# EAGLE design PCF8575_Shield (EAGLE 7.4.0)
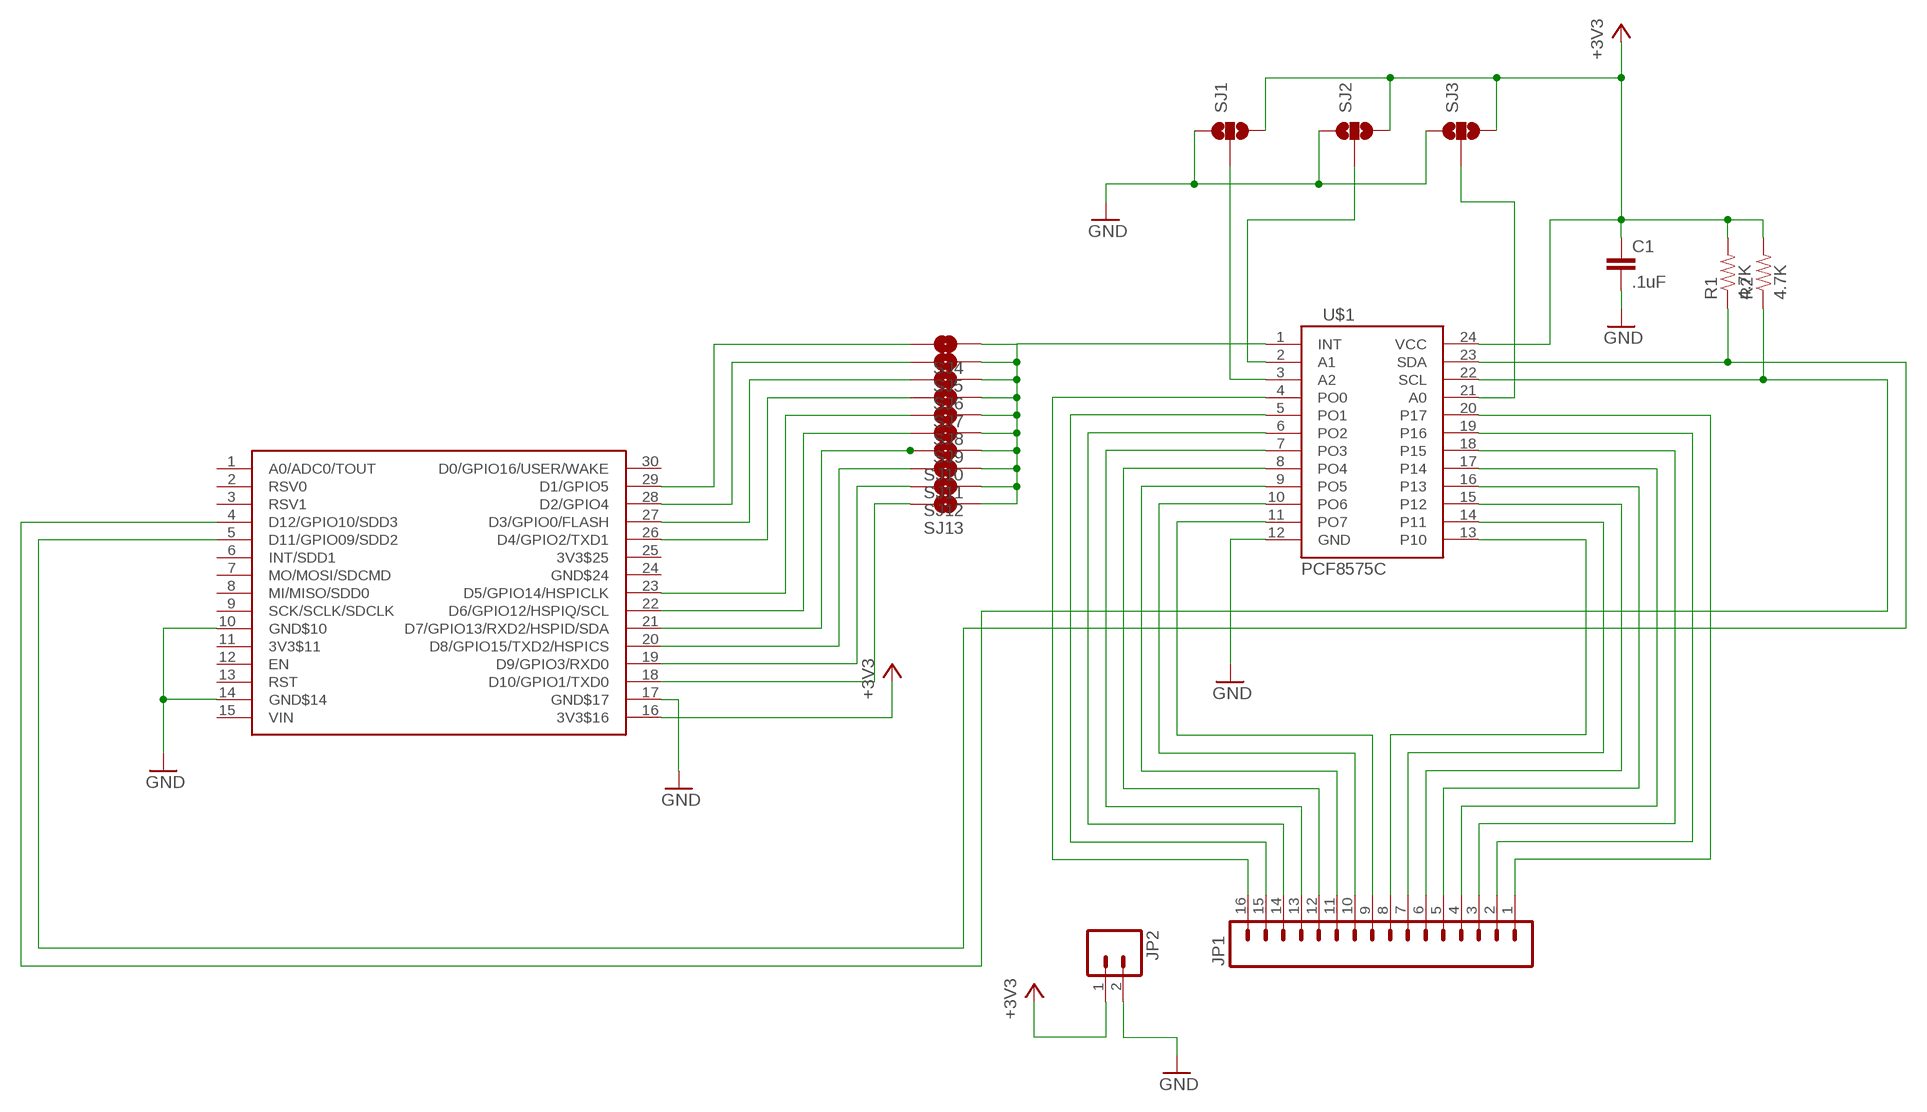
[diagram p0: schematic, sheet 1]

## Parts
C1  .1uF  CAP0603-CAP  [0603-CAP]
JP1  M161X16_NO_SILK  [1X16_NO_SILK]
JP2  M02PTH  [1X02]
R1  4.7K  RESISTOR0603-RES  [0603-RES]
R2  4.7K  RESISTOR0603-RES  [0603-RES]
SJ1  SOLDERJUMPER_2WAYPASTE1&2  [SJ_3_PASTE1&2]
SJ2  SOLDERJUMPER_2WAYPASTE1&2  [SJ_3_PASTE1&2]
SJ3  SOLDERJUMPER_2WAYPASTE1&2  [SJ_3_PASTE1&2]
SJ4  SOLDERJUMPERNO  [SJ_2S-NO]
SJ5  SOLDERJUMPERNO  [SJ_2S-NO]
SJ6  SOLDERJUMPERNO  [SJ_2S-NO]
SJ7  SOLDERJUMPERNO  [SJ_2S-NO]
SJ8  SOLDERJUMPERNO  [SJ_2S-NO]
SJ9  SOLDERJUMPERNO  [SJ_2S-NO]
SJ10  SOLDERJUMPERNO  [SJ_2S-NO]
SJ11  SOLDERJUMPERNO  [SJ_2S-NO]
SJ12  SOLDERJUMPERNO  [SJ_2S-NO]
SJ13  SOLDERJUMPERNO  [SJ_2S-NO]
U$1  PCF8575C  [SO-24DW]
U$2  NERDSHIELD  [NERDUINO_STACK]

## Nets
+3V3: C1.1 JP2.1 R1.2 R2.2 SJ1.3 SJ2.3 SJ3.3 U$1.24(VCC) U$2.16(3V3$16)
GND: C1.2 JP2.2 SJ1.1 SJ2.1 SJ3.1 U$1.12(GND) U$2.10(GND$10) U$2.14(GND$14) U$2.17(GND$17)
N$1: JP1.1 U$1.20(P17)
N$2: R1.1 U$1.23(SDA) U$2.5(D11/GPIO09/SDD2)
N$3: SJ4.1 SJ5.1 SJ6.1 SJ7.1 SJ8.1 SJ9.1 SJ10.1 SJ11.1 SJ12.1 SJ13.1 U$1.1(INT)
N$4: SJ3.2 U$1.21(A0)
N$5: R2.1 U$1.22(SCL) U$2.4(D12/GPIO10/SDD3)
N$6: SJ2.2 U$1.2(A1)
N$7: JP1.2 U$1.19(P16)
N$8: SJ1.2 U$1.3(A2)
N$9: JP1.3 U$1.18(P15)
N$10: JP1.4 U$1.17(P14)
N$11: JP1.5 U$1.16(P13)
N$12: JP1.6 U$1.15(P12)
N$13: JP1.7 U$1.14(P11)
N$14: JP1.8 U$1.13(P10)
N$15: JP1.9 U$1.11(PO7)
N$16: JP1.10 U$1.10(PO6)
N$17: JP1.11 U$1.9(PO5)
N$18: JP1.12 U$1.8(PO4)
N$19: JP1.13 U$1.7(PO3)
N$20: JP1.14 U$1.6(PO2)
N$21: JP1.15 U$1.5(PO1)
N$22: JP1.16 U$1.4(PO0)
N$23: SJ4.2 U$2.29(D1/GPIO5)
N$24: SJ5.2 U$2.28(D2/GPIO4)
N$25: SJ6.2 U$2.27(D3/GPIO0/FLASH)
N$26: SJ7.2 U$2.26(D4/GPIO2/TXD1)
N$27: SJ8.2 U$2.23(D5/GPIO14/HSPICLK)
N$28: SJ9.2 U$2.22(D6/GPIO12/HSPIQ/SCL)
N$29: SJ10.2 U$2.21(D7/GPIO13/RXD2/HSPID/SDA)
N$30: SJ11.2 U$2.20(D8/GPIO15/TXD2/HSPICS)
N$31: SJ12.2 U$2.19(D9/GPIO3/RXD0)
N$32: SJ13.2 U$2.18(D10/GPIO1/TXD0)
Unconnected: U$2.1(A0/ADC0/TOUT) U$2.2(RSV0) U$2.3(RSV1) U$2.6(INT/SDD1) U$2.7(MO/MOSI/SDCMD) U$2.8(MI/MISO/SDD0) U$2.9(SCK/SCLK/SDCLK) U$2.11(3V3$11) U$2.12(EN) U$2.13(RST) U$2.15(VIN) U$2.24(GND$24) U$2.25(3V3$25) U$2.30(D0/GPIO16/USER/WAKE)

## Library data of the parts
C1 = SparkFun:CAP: Capacitor Standard 0603 ceramic capacitor, and 0.1" leaded capacitor.
JP1 = SparkFun-Connectors:M16: 1x16 .1" header
JP2 = SparkFun:M02: Header 2 Standard 2-pin 0.1" header. Use with straight break away headers (SKU : PRT-00116), right angle break away headers (PRT-00553), swiss pins (PRT-00743), machine pins (PRT-00117), and female headers (PRT-00115). Molex polarized connector foot print use with SKU : PRT-08233 with associated crimp pins and housings.
R1 R2 = SparkFun:RESISTOR: Resistor Basic schematic elements and footprints for 0603, 1206, and PTH resistors.
SJ1-SJ3 = SparkFun:SOLDERJUMPER_2WAY: Solder Jumper 2 way solder jumper
SJ4-SJ13 = SparkFun:SOLDERJUMPER: Solder Jumper Standard SMD solder jumper. Used to automate production. Two varients : Normally Open and Normally Closed are the same, but have different paste layers. NC will have a large amount of paste and should jumper during reflow.
U$1 = SparkFun:PCF8575C: PCF8575C I/O Expander.
U$2 = NerduinoShieldLib:NERDSHIELD

## Board
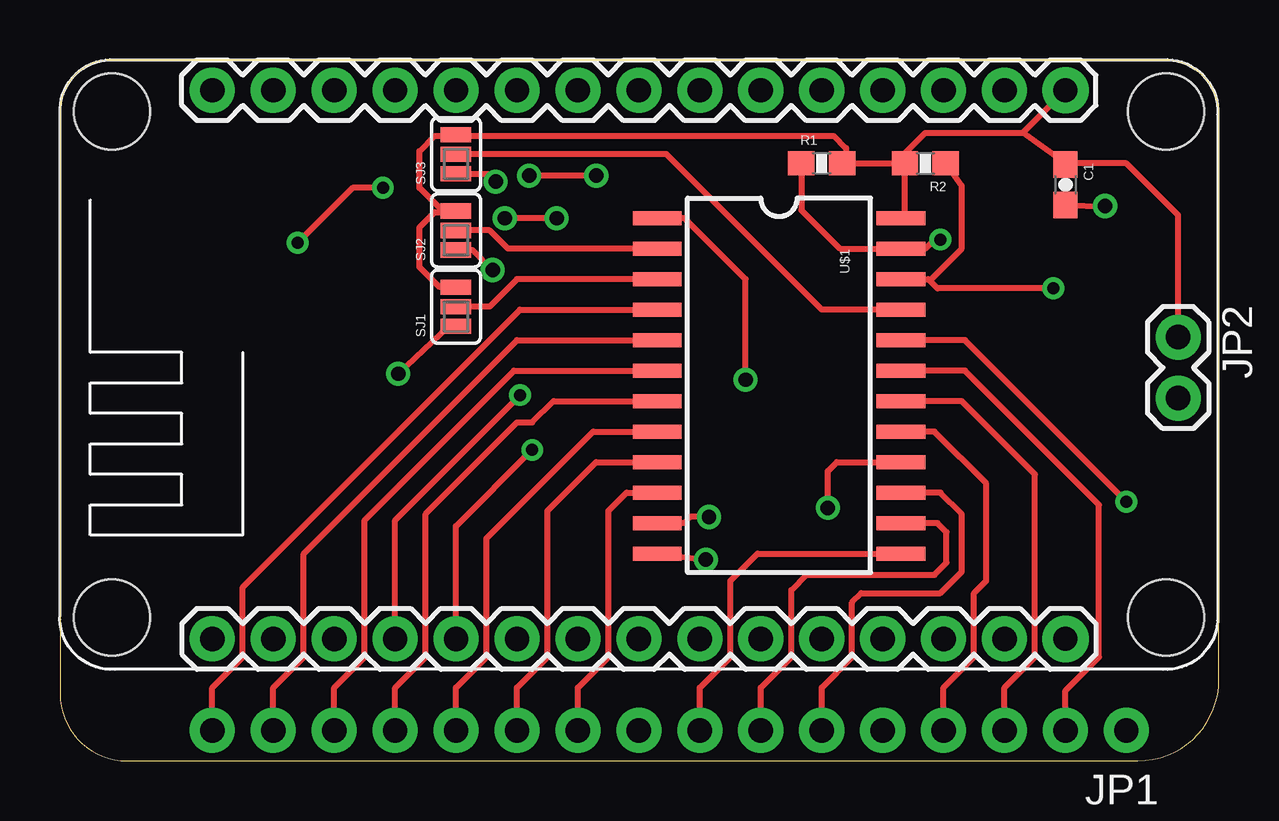
[diagram p1: board, top side]
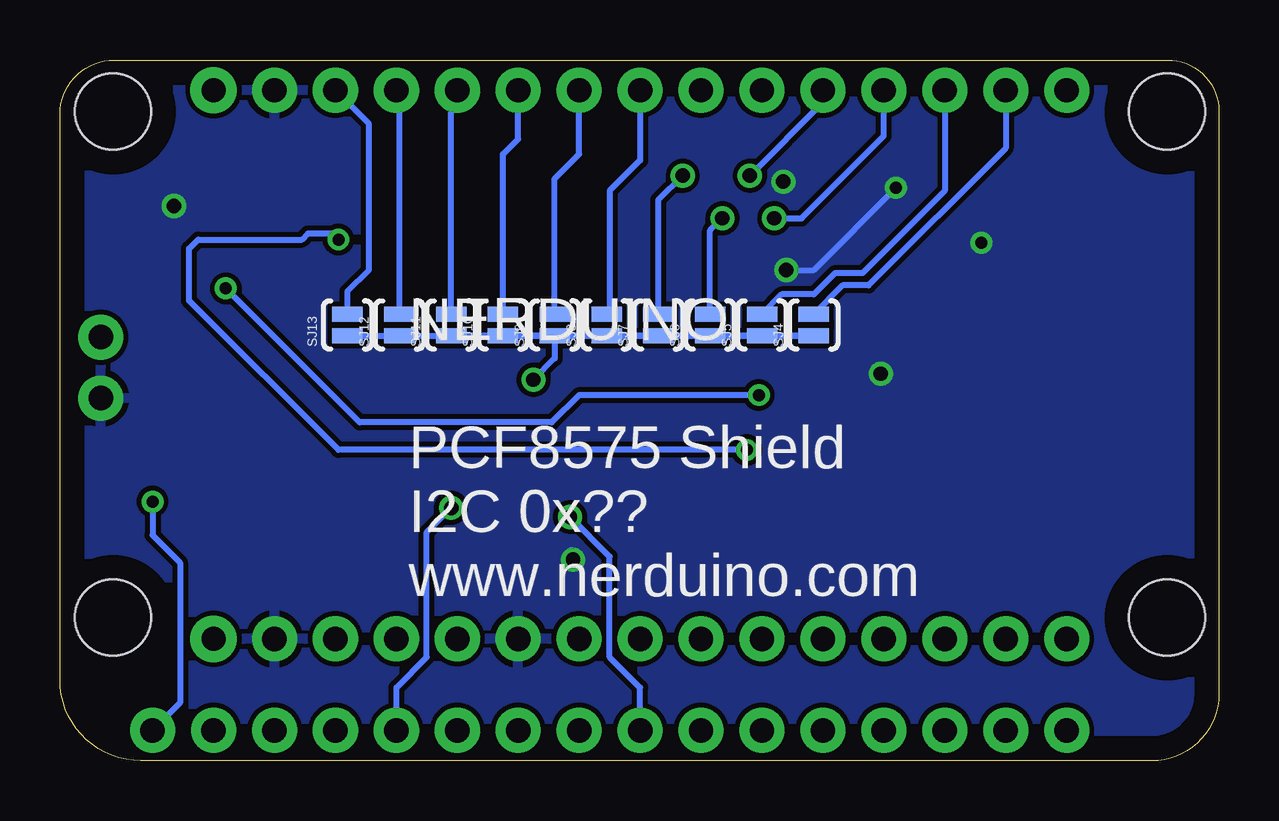
[diagram p2: board, bottom side, seen from below]

Size 48.31 x 29.2 mm. Coordinates in mm from the lower left corner, seen from the top.
Outline: 0,27.05 0,2.79 arc90 2.79,0 44.94,0 arc90 48.31,3.37 48.31,26.94 arc90 46.05,29.2 2.15,29.2 arc90 0,27.05
Copper layers (1*16): Top 0.035mm / dielectric 1.5mm / Bottom 0.035mm
Design rules "default": minimum track width 10mil, minimum drill 24mil, track to track 8mil, track to pad 8mil, pad to pad 8mil, via to via 8mil, smd to smd 8mil, copper to edge 40mil, drill to drill 8mil, minimum pad ring 10mil, minimum via ring 8mil, stop-mask expansion 4mil, vias tented up to drill 0mil, thermal gap 10mil

### Footprints (pad centres in the part's own frame; a part is rotated, then mirrored left to right if it is on the bottom)
0603-CAP = smd 1.1 x 1: 1 -0.85,0; 2 0.85,0
1X16_NO_SILK = drill 1.016 pad 1.88: 1 0,0; 2 2.54,0; 3 5.08,0; 4 7.62,0; 5 10.16,0; 6 12.7,0; 7 15.24,0; 8 17.78,0; 9 20.32,0; 10 22.86,0; 11 25.4,0; 12 27.94,0; 13 30.48,0; 14 33.02,0; 15 35.56,0; 16 38.1,0
1X02 = drill 1.016 pad 1.88: 1 0,0; 2 2.54,0
0603-RES = smd 1.1 x 1: 1 -0.85,0; 2 0.85,0
SJ_3_PASTE1&2 = smd 0.635 x 1.27: 1 -0.813,0; 2 0,0; 3 0.813,0
SJ_2S-NO = smd 0.635 x 1.27: 1 -0.45,0; 2 0.45,0
SO-24DW = smd 0.584 x 2.032: 1 -6.35,-5.08; 2 -5.08,-5.08; 3 -3.81,-5.08; 4 -2.54,-5.08; 5 -1.27,-5.08; 6 0,-5.08; 7 1.27,-5.08; 8 2.54,-5.08; 9 3.81,-5.08; 10 5.08,-5.08; 11 6.35,-5.08; 12 7.62,-5.08; 13 7.62,5.08; 14 6.35,5.08; 15 5.08,5.08; 16 3.81,5.08; 17 2.54,5.08; 18 1.27,5.08; 19 0,5.08; 20 -1.27,5.08; 21 -2.54,5.08; 22 -3.81,5.08; 23 -5.08,5.08; 24 -6.35,5.08
NERDUINO_STACK = drill 1.016 pad 1.88: 1 -17.78,-5.08; 2 -15.24,-5.08; 3 -12.7,-5.08; 4 -10.16,-5.08; 5 -7.62,-5.08; 6 -5.08,-5.08; 7 -2.54,-5.08; 8 0,-5.08; 9 2.54,-5.08; 10 5.08,-5.08; 11 7.62,-5.08; 12 10.16,-5.08; 13 12.7,-5.08; 14 15.24,-5.08; 17 15.24,17.78; 18 12.7,17.78; 19 10.16,17.78; 20 7.62,17.78; 21 5.08,17.78; 22 2.54,17.78; 23 0,17.78; 24 -2.54,17.78; 25 -5.08,17.78; 26 -7.62,17.78; 27 -10.16,17.78; 28 -12.7,17.78; 29 -15.24,17.78; 30 -17.78,17.78 | drill 1 pad 1.93: 15 17.78,-5.08; 16 17.78,17.78 | hole 3.175: -21.971,16.891; -21.971,-4.191; 21.971,-4.191; 21.971,16.891

### Placement (x,y rotation side)
C1  41.91,24 270 top
JP1  44.45,1.27 180 top
JP2  46.61,17.65 270 top
R1  31.75,24.89 0 top
R2  36.07,24.89 180 top
SJ1  16.51,18.92 90 top
SJ2  16.51,22.1 90 top
SJ3  16.51,25.27 90 top
SJ4  16.89,18.16 90 bottom
SJ5  19.05,18.16 90 bottom
SJ6  21.21,18.16 90 bottom
SJ7  23.37,18.16 90 bottom
SJ8  25.53,18.16 90 bottom
SJ9  27.69,18.16 90 bottom
SJ10  29.84,18.16 90 bottom
SJ11  32,18.16 90 bottom
SJ12  34.16,18.16 90 bottom
SJ13  36.32,18.16 90 bottom
U$1  29.97,16.26 270 top
U$2  24.13,10.16 0 top

### Tracks (layer width: path | path; a pad name or v marks a point on that pad's centre or on a via)
+3V3
  Top 0.254: U$1.24 35.22,22.61 R2.2 | R2.2 35.22,25.31 36.07,26.16 40.13,26.16 | 40.13,26.16 U$2.16 | R2.2 R1.2 32.77,25.06 32.77,25.53 32.26,26.04 16.56,26.04 SJ3.3 16.46,26.04 15.62,26.04 14.99,25.4 14.99,23.88 15.95,22.91 SJ2.3 16.46,22.86 15.62,22.86 14.99,22.23 14.99,20.57 15.82,19.74 SJ1.3 | 40.13,26.16 41.91,24.89 C1.1 41.91,25.15 42.16,24.89 44.45,24.89 46.61,22.73 JP2.1
GND  (via drill 0.5, 0.6)
  Top 0.254: C1.2 v43.56,23.11 | U$1.12 v26.92,8.38 | SJ1.1 16.2,18.11 v14.1,16.13 | SJ3.1 17.83,24.46 v18.16,24.13 | SJ2.1 17.2,21.29 v18.03,20.45 | v13.46,23.88 12.19,23.88 v9.91,21.59
  Bottom 0.254: v43.56,23.11 43.82,22.99 | v26.92,8.38 26.92,8.76 27.05,8.76 | v14.1,16.13 14.1,16.26 | v18.16,24.13 18.29,24.13 18.41,24 | 18.16,20.57 v18.03,20.45 16.89,20.45 v13.46,23.88 | v9.91,21.59 9.91,21.34
  pour Bottom: 0.13,29.08 48.26,29.21 48.26,0.25 0.13,0.13
N$1  (via drill 0.5)
  Top 0.254: v44.45,10.79 37.72,17.53 U$1.20
  Bottom 0.254: v44.45,10.79 44.45,9.4 43.31,8.26 43.31,2.41 JP1.1
N$2  (via drill 0.5)
  Top 0.254: R1.1 30.9,22.95 32.51,21.34 U$1.23 36.07,21.34 36.45,21.72 v36.7,21.72 | U$2.5 16.51,9.78 v19.68,12.95
  Bottom 0.254: v19.68,12.95 36.7,12.95 42.93,19.18 42.93,21.34 42.55,21.72 38.23,21.72 37.97,21.97 36.96,21.97 v36.7,21.72
N$3  (via drill 0.6)
  Top 0.254: v28.57,15.88 28.57,20.07 26.04,22.61 U$1.1
  Bottom 0.254: SJ13.1 SJ12.1 SJ4.1 SJ5.1 SJ6.1 SJ7.1 SJ8.1 SJ9.1 | SJ9.1 27.69,16.76 v28.57,15.88 | SJ9.1 SJ10.1 SJ11.1
N$4
  Top 0.254: U$1.21 31.75,18.8 25.27,25.27 SJ3.2
N$5  (via drill 0.5)
  Top 0.254: U$1.22 36.2,20.07 | 36.2,20.07 36.32,20.07 37.59,21.34 37.59,23.96 R2.1 | U$2.4 13.97,10.03 v19.18,15.24 | v41.4,19.68 36.58,19.68 36.2,20.07
  Bottom 0.254: v19.18,15.24 26.67,15.24 27.81,14.1 35.81,14.1 v41.4,19.68
N$6
  Top 0.254: U$1.2 18.67,21.34 17.91,22.1 SJ2.2
N$7
  Top 0.254: JP1.2 41.91,2.92 43.31,4.32 43.31,10.67 37.72,16.26 U$1.19
N$8
  Top 0.254: U$1.3 19.05,20.07 17.91,18.92 SJ1.2
N$9
  Top 0.254: JP1.3 39.37,3.05 40.64,4.32 40.64,11.94 37.59,14.99 U$1.18
N$10
  Top 0.254: JP1.4 36.83,3.05 38.1,4.32 38.1,6.99 38.61,7.49 38.61,11.56 36.45,13.72 U$1.17
N$11  (via drill 0.6)
  Top 0.254: v32,10.54 32,12.06 32.39,12.45 U$1.16
  Bottom 0.254: JP1.5 34.29,3.05 33.02,4.32 33.02,9.53 v32,10.54
N$12
  Top 0.254: JP1.6 31.75,3.05 33.02,4.32 33.02,6.6 33.4,6.99 36.7,6.99 37.59,7.87 37.59,10.29 36.7,11.18 U$1.15
N$13
  Top 0.254: JP1.7 29.21,3.05 30.48,4.32 30.48,7.11 31.11,7.75 36.45,7.75 36.96,8.26 36.96,9.53 36.58,9.91 U$1.14
N$14
  Top 0.254: JP1.8 26.67,3.05 27.94,4.32 27.94,7.49 29.08,8.64 U$1.13
N$15  (via drill 0.6)
  Top 0.254: v27.05,10.16 26.29,10.16 26.04,9.91 U$1.11
  Bottom 0.254: JP1.9 24.13,3.05 25.4,4.32 25.4,8.51 v27.05,10.16
N$16
  Top 0.254: JP1.10 21.59,3.05 22.86,4.32 22.86,10.41 23.62,11.18 U$1.10
N$17
  Top 0.254: JP1.11 19.05,3.05 20.32,4.32 20.32,10.41 22.35,12.45 U$1.9
N$18
  Top 0.254: JP1.12 16.51,3.05 17.78,4.32 17.78,9.27 22.22,13.72 U$1.8
N$19
  Top 0.254: JP1.13 13.97,3.05 15.24,4.32 15.24,10.29 19.05,14.1 19.68,14.1 20.57,14.99 U$1.7
N$20
  Top 0.254: JP1.14 11.43,3.05 12.7,4.32 12.7,10.03 18.92,16.26 U$1.6
N$21
  Top 0.254: JP1.15 8.89,3.05 10.16,4.32 10.16,8.64 19.05,17.53 U$1.5
N$22
  Top 0.254: JP1.16 6.35,3.05 7.62,4.32 7.62,7.24 19.18,18.8 U$1.4
N$23
  Bottom 0.254: U$2.29 8.89,25.53 14.61,19.81 15.69,19.81 SJ4.2
N$24
  Bottom 0.254: U$2.28 11.43,23.75 14.86,20.32 16,20.32 16.89,19.43 18.23,19.43 SJ5.2
N$25  (via drill 0.6)
  Top 0.254: v20.7,22.61 v18.54,22.61
  Bottom 0.254: SJ6.2 21.21,22.1 v20.7,22.61 | v18.54,22.61 17.4,22.61 13.97,26.04 U$2.27
N$26  (via drill 0.6)
  Top 0.254: v22.35,24.38 v19.56,24.38
  Bottom 0.254: SJ7.2 23.37,23.37 v22.35,24.38 | v19.56,24.38 16.51,27.43 U$2.26
N$27
  Bottom 0.254: U$2.23 24.13,25.02 25.4,23.75 25.4,18.74 SJ8.2
N$28
  Bottom 0.254: SJ9.2 27.69,24.26 26.67,25.27 U$2.22
N$29
  Bottom 0.254: SJ10.2 29.84,25.27 29.21,25.91 U$2.21
N$30
  Bottom 0.254: SJ11.2 32,27.05 31.75,27.3 U$2.20
N$31
  Bottom 0.254: SJ12.2 34.16,27.81 U$2.19
N$32
  Bottom 0.254: SJ13.2 36.32,19.56 35.43,20.45 35.43,26.54 U$2.18

### Text on the board
_bsilk: NERDUINO / / PCF8575 Shield / I2C 0x?? / www.nerduino.com